# Altium project iMX6 Rex Development Baseboard V1I1.PrjPcb (part 2 of 2)

## Sheet [08] - LVDS.SchDoc
size A3; DocumentNumber: 2; SheetNumber: 8; SheetTotal: 20
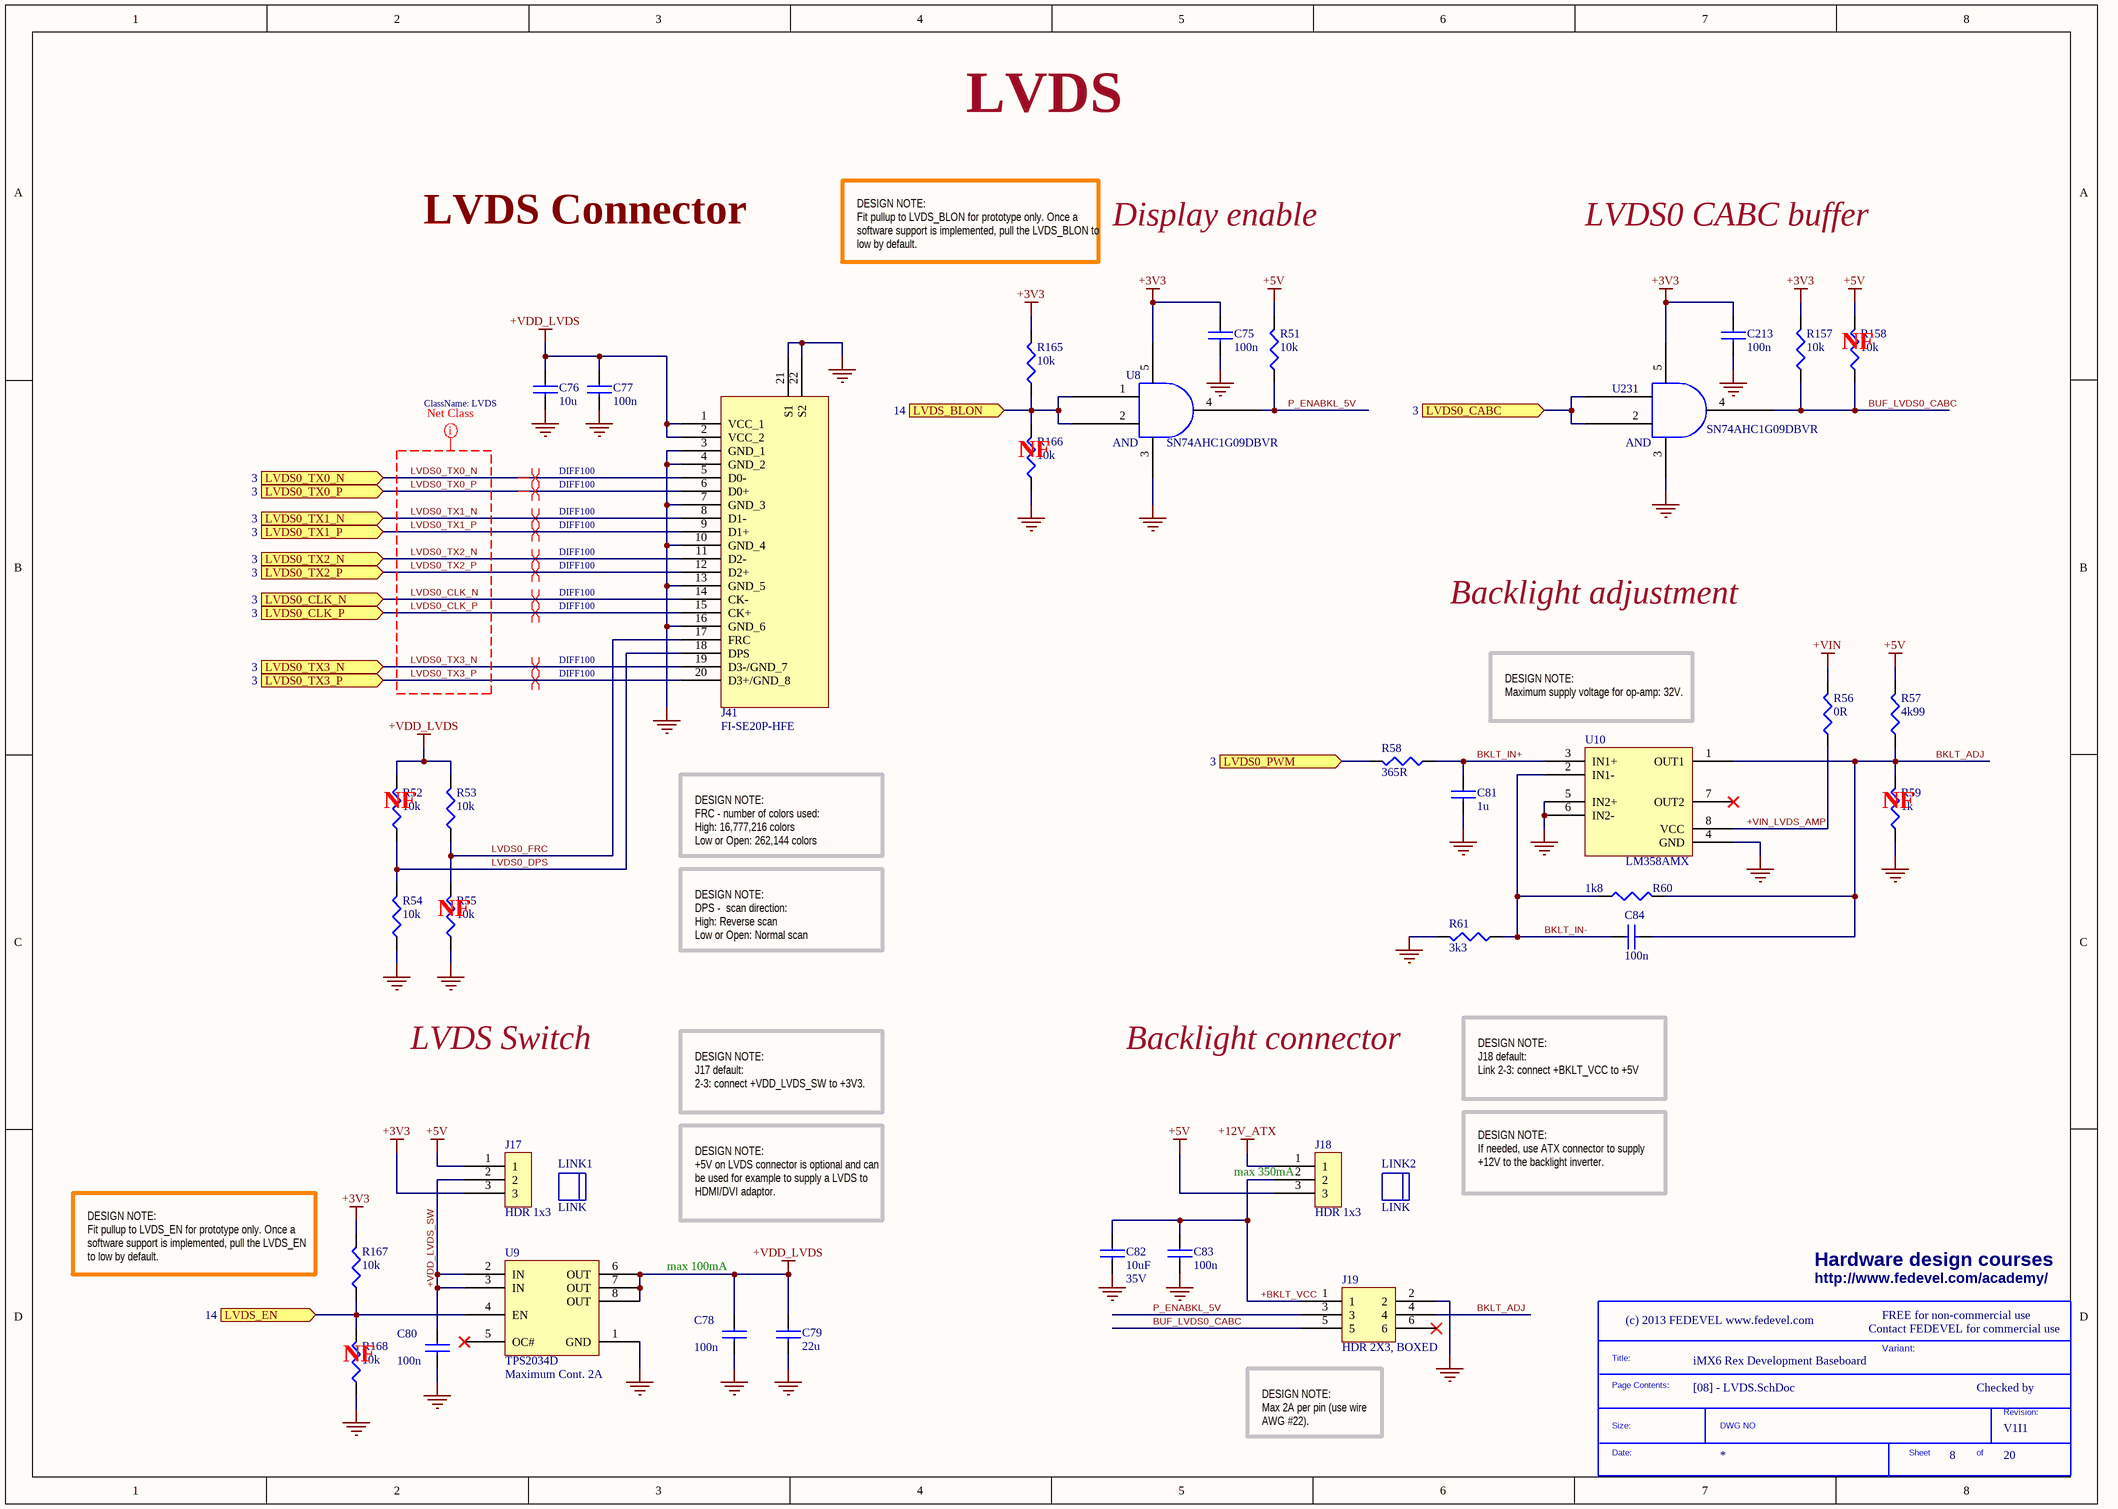
[diagram p4: [08] - LVDS.SchDoc]

### Parts
(Parts that share a designator on the sheet are numbered #1, #2 ... from top to bottom, then left to right.)
*#3  SDTitleBlock  (value not drawn)  (graphical)
C75  100n  [C0402]
C76  10u  [C0603]
C77  100n  [C0402]
C78  100n  [C0402]
C79  22u  [C0805]
C80  100n  [C0402]
C81  1u  [C0402]
C82  10uF  Voltage - Rated: 35V  [C1206]
C83  100n  [C0402]
C84  100n  [C0402]
C213  100n  [C0402]
J17  HDR 1x3  [Hdr_1x3_2.54mm]
J18  HDR 1x3  [Hdr_1x3_2.54mm]
J19  HDR 2X3, BOXED  [HDR_2x3_2.54mm_BOXED]
J41  FI-SE20P-HFE  [FI-SE20P-HFE]
LINK1  LINK  (mechanical)
LINK2  LINK  (mechanical)
R51  10k  [R0402]
R52  10k  [R0402]
R53  10k  [R0402]
R54  10k  [R0402]
R55  10k  [R0402]
R56  0R  [R0402]
R57  4k99  [R0402]
R58  365R  [R0402]
R59  1k  [R0402]
R60  1k8  [R0402]
R61  3k3  [R0402]
R157  10k  [R0402]
R158  10k  [R0402]
R165  10k  [R0402]
R166  10k  [R0402]
R167  10k  [R0402]
R168  10k  [R0402]
U8  SN74AHC1G09DBVR  [DBV_SOT_23_5]
U9  TPS2034D  [8_SOIC_3.9MM]
U10  LM358AMX  [8_SOIC_3.9MM]
U23  SN74AHC1G09DBVR  [DBV_SOT_23_5]

### Ports
LVDS0_CABC (in, see 3), LVDS0_CLK_N (in, see 3), LVDS0_CLK_P (in, see 3), LVDS0_PWM (in, see 3), LVDS0_TX0_N (in, see 3), LVDS0_TX0_P (in, see 3), LVDS0_TX1_N (in, see 3), LVDS0_TX1_P (in, see 3), LVDS0_TX2_N (in, see 3), LVDS0_TX2_P (in, see 3), LVDS0_TX3_N (in, see 3), LVDS0_TX3_P (in, see 3), LVDS_BLON (in, see 14), LVDS_EN (in, see 14)

### Nets
+3V3: C75.1 C213.1 J17.3 R157.2 R165.2 R167.2 U8.5(VCC) U23.5(VCC)
+5V: J17.1 J18.3 R51.2 R57.2 R158.2
+12V_ATX: J18.1
+VDD_LVDS: C76.1 C77.1 C78.1 C79.1 J41.1(VCC_1) J41.2(VCC_2) R52.2 R53.2 U9.6(OUT) U9.7(OUT) U9.8(OUT)
+VIN: R56.2
GND: C75.2 C76.2 C77.2 C78.2 C79.2 C80.2 C81.2 C82.2 C83.2 C213.2 J19.2 J41.3(GND_1) J41.4(GND_2) J41.7(GND_3) J41.10(GND_4) J41.13(GND_5) J41.16(GND_6) J41.21(S1) J41.22(S2) R54.1 R55.1 R59.1 R61.2 R166.1 R168.1 U8.3(GND) U9.1(GND) U10.4(GND) U10.5(IN2+) U10.6(IN2-) U23.3(GND)
+BKLT_VCC: C82.1 C83.1 J18.2 J19.1
+VDD_LVDS_SW: C80.1 J17.2 U9.2(IN) U9.3(IN)
+VIN_LVDS_AMP: R56.1 U10.8(VCC)
BKLT_ADJ: C84.2 J19.4 R57.1 R59.2 R60.2 U10.1(OUT1)
BKLT_IN+: C81.1 R58.1 U10.3(IN1+)
BKLT_IN-: C84.1 R60.1 R61.1 U10.2(IN1-)
BUF_LVDS0_CABC: J19.5 R157.1 R158.1 U23.4(Y)
LVDS0_CABC: U23.1(A) U23.2(B) ; port LVDS0_CABC
LVDS0_CLK_N: J41.14(CK-) ; port LVDS0_CLK_N
LVDS0_CLK_P: J41.15(CK+) ; port LVDS0_CLK_P
LVDS0_DPS: J41.18(DPS) R52.1 R54.2
LVDS0_FRC: J41.17(FRC) R53.1 R55.2
LVDS0_PWM: R58.2 ; port LVDS0_PWM
LVDS0_TX0_N: J41.5(D0-) ; port LVDS0_TX0_N
LVDS0_TX0_P: J41.6(D0+) ; port LVDS0_TX0_P
LVDS0_TX1_N: J41.8(D1-) ; port LVDS0_TX1_N
LVDS0_TX1_P: J41.9(D1+) ; port LVDS0_TX1_P
LVDS0_TX2_N: J41.11(D2-) ; port LVDS0_TX2_N
LVDS0_TX2_P: J41.12(D2+) ; port LVDS0_TX2_P
LVDS0_TX3_N: J41.19(D3-/GND_7) ; port LVDS0_TX3_N
LVDS0_TX3_P: J41.20(D3+/GND_8) ; port LVDS0_TX3_P
LVDS_BLON: R165.1 R166.2 U8.1(A) U8.2(B) ; port LVDS_BLON
LVDS_EN: R167.1 R168.2 U9.4(EN) ; port LVDS_EN
P_ENABKL_5V: J19.3 R51.1 U8.4(Y)

Not connected (* = marked no-connect by the designer): J19 6*; U9 5(OC#)*; U10 7(OUT2)*

### Layout directives
differential pair; net class DIFF100: LVDS0_CLK_N, LVDS0_CLK_P, LVDS0_TX0_N, LVDS0_TX0_P, LVDS0_TX1_N, LVDS0_TX1_P, LVDS0_TX2_N, LVDS0_TX2_P, LVDS0_TX3_N, LVDS0_TX3_P
net class LVDS: LVDS0_CLK_N, LVDS0_CLK_P, LVDS0_TX0_N, LVDS0_TX0_P, LVDS0_TX1_N, LVDS0_TX1_P, LVDS0_TX2_N, LVDS0_TX2_P, LVDS0_TX3_N, LVDS0_TX3_P

### Notes on the sheet
- LVDS
- LVDS Connector
- Display enable
- LVDS0 CABC buffer
- DESIGN NOTE:
  Fit pullup to LVDS_BLON for prototype only. Once a software support is implemented, pull the LVDS_BLON to low by default.
- (near R158) NF
- (near R166) NF
- Backlight adjustment
- (near U10) DESIGN NOTE:
  Maximum supply voltage for op-amp: 32V.
- (near R52) NF
- DESIGN NOTE:
  FRC - number of colors used:
  High: 16,777,216 colors
  Low or Open: 262,144 colors
- (near R59) NF
- (near R55) NF
- DESIGN NOTE:
  DPS -  scan direction:
  High: Reverse scan
  Low or Open: Normal scan
- LVDS Switch
- Backlight connector
- DESIGN NOTE:
  J17 default:
  2-3: connect +VDD_LVDS_SW to +3V3.
- DESIGN NOTE:
  J18 default:
  Link 2-3: connect +BKLT_VCC to +5V
- (near J18) max 350mA
- DESIGN NOTE:
  If needed, use ATX connector to supply +12V to the backlight inverter.
- DESIGN NOTE:
  +5V on LVDS connector is optional and can be used for example to supply a LVDS to HDMI/DVI adaptor.
- Hardware design courses
- (near R167) DESIGN NOTE:
  Fit pullup to LVDS_EN for prototype only. Once a software support is implemented, pull the LVDS_EN to low by default.
- max 100mA
- http://www.fedevel.com/academy/
- Contact FEDEVEL for commercial use
- FREE for non-commercial use
- (near R168) NF
- (near U9) Maximum Cont. 2A
- Variant:
- Checked by
- DESIGN NOTE:
  Max 2A per pin (use wire AWG #22).
- (in symbol SDTitleBlock) Title:; Page Contents:; Revision:; Size:; DWG NO; Date:; Sheet; of
- (in symbol SN74AHC1G09DBVR) AND

### Library data of the parts
C75 C77 C78 C80 C83 C84 C213 = C1005X5R1H104K: CAP CER .10UF 50V X5R 10% 0402; Manufacturer: TDK Corporation; Capacitance: 0.1µF; Value: 100nF; .Checked PCB: used; Description: CAP CER 0.1UF 50V 10% X5R 0402; Category: Capacitors; Manufacturer Part Number: C1005X5R1H104K; Operating Temperature: -55°C ~ 85°C; Package / Case: 0402 (1005 Metric); Price 1k [$]: 0.02340; .Checked SCH: used; Voltage - Rated: 50V; Supplier Part Number: 445-5942-1-ND; Supplier: Digikey; Supplier 1: Digi-Key; Supplier Part Number 1: 445-5942-1-ND; RoHS: RoHS Compliant; Stock 1: 106926; Pricing 1: 1=0.27, 10=0.18, 100=0.072, 250=0.05176, 500=0.0369, 1000=0.027 (USD); Tolerance: ±10%; Temperature Coefficient: X5R; Mounting Type: Surface Mount, MLCC; Applications: General Purpose; Ratings: -; Size / Dimension: 0.039" L x 0.020" W (1.00mm x 0.50mm); Height - Seated (Max): -; Thickness (Max): 0.022" (0.55mm); Lead Spacing: -; Features: -; Packaging: Cut Tape (CT); Lead Style: -; ComponentLink1URL: http://www.tdk.co.jp/tefe02/e412_c.pdf; ComponentLink1Description: http://www.tdk.co.jp/tefe02/e412_c.pdf
C76 = C1608X5R0J106M: CAP CER 10UF 6.3V X5R 20% 0603; Manufacturer: TDK Corporation; Capacitance: 10µF; Value: 10µF; .Checked PCB: used; Description: CAP CER 10UF 6.3V 20% X5R 0603; Category: Capacitors; Supplier Part Number: 445-4112-1-ND; Manufacturer Part Number: C1608X5R0J106M; Operating Temperature: -55°C ~ 85°C; Package / Case: 0603 (1608 Metric); Price 1k [$]: 0.08580; .Checked SCH: used; Voltage - Rated: 6.3V; Features: Low ESR; Supplier: Digikey; Supplier 1: Digi-Key; Supplier Part Number 1: 445-4112-1-ND; RoHS: RoHS Compliant; Stock 1: 48157; Pricing 1: 1=0.46, 10=0.363, 100=0.1898, 250=0.14024, 500=0.1089, 1000=0.0858 (USD); Tolerance: ±20%; Temperature Coefficient: X5R; Mounting Type: Surface Mount, MLCC; Applications: General Purpose; Ratings: -; Size / Dimension: 0.063" L x 0.031" W (1.60mm x 0.80mm); Height - Seated (Max): -; Thickness (Max): 0.037" (0.95mm); Lead Spacing: -; Packaging: Cut Tape (CT); Lead Style: -; ComponentLink1URL: http://www.tdk.com/pdf/general_B11.pdf; ComponentLink1Description: http://www.tdk.com/pdf/general_B11.pdf
C79 = C2012X5R1C226K: CAP CER 22UF 16V 10% X5R 0805; Manufacturer: TDK Corporation; Capacitance: 22µF; .Checked PCB: RF; Supplier 1: Digi-Key; Supplier Part Number 1: 445-6797-1-ND; Manufacturer Part Number: C2012X5R1C226K; RoHS: RoHS Compliant; Category: Capacitors; Stock 1: 15408; Pricing 1: 1=0.77, 10=0.737, 100=0.3575, 250=0.297, 500=0.2695, 1000=0.2475 (USD); Voltage - Rated: 16V; Tolerance: ±10%; Temperature Coefficient: X5R; Mounting Type: Surface Mount, MLCC; Operating Temperature: -55°C ~ 85°C; Applications: General Purpose; Ratings: -; Package / Case: 0805 (2012 Metric); Size / Dimension: 0.079" L x 0.049" W (2.00mm x 1.25mm); Height - Seated (Max): -; Thickness (Max): 0.057" (1.45mm); Lead Spacing: -; Features: -; Packaging: Cut Tape (CT); Lead Style: -; ComponentLink1URL: http://www.tdk.com/pdf/general_B11.pdf; ComponentLink1Description: http://www.tdk.com/pdf/general_B11.pdf; .Checked SCH: RF
C81 = C1005X5R1C105K: CAP CER 1.0UF 16V X5R 0402; Manufacturer: TDK Corporation; Capacitance: 1.0µF; Value: 1uF; .Checked PCB: used; Description: CAP CER 1UF 16V 10% X5R 0402; Tolerance: ±10%; Category: Capacitors; Supplier Part Number: 445-4978-1-ND; Manufacturer Part Number: C1005X5R1C105K; Operating Temperature: -55°C ~ 85°C; Package / Case: 0402 (1005 Metric); Price 1k [$]: 0.02080; .Checked SCH: used; Voltage - Rated: 16V; Supplier: Digikey; Supplier 1: Digi-Key; Supplier Part Number 1: 445-4978-1-ND; RoHS: RoHS Compliant; Stock 1: 341010; Pricing 1: 1=0.24, 10=0.16, 100=0.064, 250=0.046, 500=0.0328, 1000=0.024 (USD); Temperature Coefficient: X5R; Mounting Type: Surface Mount, MLCC; Applications: General Purpose; Ratings: -; Size / Dimension: 0.039" L x 0.020" W (1.00mm x 0.50mm); Height - Seated (Max): -; Thickness (Max): 0.022" (0.55mm); Lead Spacing: -; Features: -; Packaging: Cut Tape (CT); Lead Style: -; ComponentLink1URL: http://www.tdk.co.jp/tefe02/e412_c.pdf; ComponentLink1Description: http://www.tdk.co.jp/tefe02/e412_c.pdf
C82 = GRM31CR6YA106KA12L: CAP CER 10UF 35V X5R 1206; Manufacturer: Murata Electronics North America; Capacitance: 10µF; .Checked PCB: used; Description: CAP CER 10UF 35V 10% X5R 1206; Tolerance: ±10%; Category: Capacitors; Supplier Part Number: 490-5524-1-ND; Manufacturer Part Number: GRM31CR6YA106KA12L; Operating Temperature: -55°C ~ 85°C; Package / Case: 1206 (3216 Metric); Price 1k [$]: 0.19448; Value: 10uF; .Checked SCH: used; Supplier: Digikey; Supplier 1: Digi-Key; Supplier Part Number 1: 490-5524-1-ND; RoHS: RoHS Compliant; Stock 1: 76334; Pricing 1: 1=0.6, 10=0.501, 50=0.359, 100=0.3142, 250=0.24684, 500=0.2244, 1000=0.17952 (USD); Temperature Coefficient: X5R; Mounting Type: Surface Mount, MLCC; Applications: General Purpose; Ratings: -; Size / Dimension: 0.126" L x 0.063" W (3.20mm x 1.60mm); Height - Seated (Max): -; Thickness (Max): 0.071" (1.80mm); Lead Spacing: -; Features: -; Packaging: Cut Tape (CT); Lead Style: -; ComponentLink1URL: http://www.murata.com/products/catalog/pdf/c02e.pdf; ComponentLink1Description: http://www.murata.com/products/catalog/pdf/c02e.pdf
J17 J18 = 68000-103HLF: BERGSTIK II .100" SR STRAIGHT; Manufacturer: FCI; Connector Type: Header, Unshrouded; Number of Positions: 3; Number of Positions Loaded: All; Pitch: 0.100" (2.54mm); .Creator: MM; Supplier 1: Digi-Key; Manufacturer Part Number: 68000-103HLF; RoHS: RoHS Compliant; Category: Connectors, Interconnects; Stock 1: 37214; Pricing 1: 1=0.15, 10=0.145, 25=0.108, 50=0.0924 (USD); Packaging: Bulk; Contact Type: Male Pin; Number of Rows: 1; Row Spacing: -; Contact Mating Length: 0.230" (5.84mm); Mounting Type: Through Hole; Termination: Solder; Fastening Type: -; Features: -; Contact Finish: Gold or Gold, GXT™; Contact Finish Thickness: 30µin (0.76µm); Color: Black; ComponentLink1URL: http://portal.fciconnect.com/Comergent//fci/drawing/68000.pdf; ComponentLink1Description: http://portal.fciconnect.com/Comergent//fci/drawing/68000.pdf; Supplier Part Number 1: 609-3461-ND; .Checked PCB: MM; .Checked SCH: MM
J19 = 30306-6002HB: CONN HEADER 6POS DL STR GOLD; Manufacturer: 3M; Connector Type: Header, Shrouded; Number of Positions: 6; Number of Positions Loaded: All; Pitch: 0.100" (2.54mm); .Creator: MM; Supplier 1: Digi-Key; Manufacturer Part Number: 30306-6002HB; RoHS: RoHS Compliant; Category: Connectors, Interconnects; Stock 1: 1262; Pricing 1: 1=0.64, 10=0.6, 25=0.54, 50=0.48, 100=0.46, 250=0.42, 500=0.4, 1000=0.33, 2500=0.3 (USD); Packaging: Bulk; Contact Type: Male Pin; Number of Rows: 2; Row Spacing: 0.100" (2.54mm); Contact Mating Length: 0.236" (6.00mm); Mounting Type: Through Hole; Termination: Solder; Fastening Type: -; Features: -; Contact Finish: Gold; Contact Finish Thickness: Flash; Color: Black; ComponentLink1URL: http://multimedia.3m.com/mws/mediawebserver?6666660Zjcf6lVs6EVs666UdhCOrrrrQ-; ComponentLink1Description: http://multimedia.3m.com/mws/mediawebserver?6666660Zjcf6lVs6EVs666UdhCOrrrrQ-; Supplier Part Number 1: 3M15451-ND; .Checked PCB: MM; .Checked SCH: MM
J41 = FI-SE20P-HFE: CONN RCPT 1.25MM 20POS SMD R/A; Manufacturer: JAE Electronics; Connector Type: Receptacle; Number of Positions: 20; Number of Positions Loaded: All; Pitch: 0.049" (1.25mm); .Creator: MM; Supplier 1: Digi-Key; Manufacturer Part Number: FI-SE20P-HFE; RoHS: RoHS Compliant; Category: Connectors, Interconnects; Stock 1: 7292; Pricing 1: 1=4.93, 10=4.728, 25=4.334, 100=3.94, 250=3.44752, 500=3.349, 1000=2.8565 (USD); Packaging: Tray; Contact Type: Male Pin; Number of Rows: 1; Row Spacing: -; Contact Mating Length: -; Mounting Type: Surface Mount, Right Angle; Termination: Solder; Fastening Type: Friction Lock; Features: Solder Retention; Contact Finish: Gold; Contact Finish Thickness: -; Color: Beige; ComponentLink1URL: http://jae-connector.com/en/pdf/SJ100489.pdf; ComponentLink1Description: http://jae-connector.com/en/pdf/SJ100489.pdf; Supplier Part Number 1: 670-1843-ND; .Checked PCB: MM; .Checked SCH: MM
LINK1 LINK2 = QPC02SXGN-RC: CONN JUMPER SHORTING .100" GOLD; Manufacturer: Sullins Connector Solutions; Gender: Female Sockets; Number of Positions or Pins (Grid): 2 (1 x 2); Pitch: 0.100" (2.54mm); .Checked SCH: RF; Supplier 1: Digi-Key; Supplier Part Number 1: S9337-ND; Manufacturer Part Number: QPC02SXGN-RC; RoHS: RoHS Compliant; Category: Connectors, Interconnects; Stock 1: 23274; Pricing 1: 1=0.11, 10=0.066, 25=0.0468, 50=0.0384, 100=0.033, 250=0.02792, 500=0.0258, 1000=0.0228, 2500=0.018 (USD); Type: Open Top; Height: 0.235" (5.97mm); Contact Finish: Gold; Contact Finish Thickness: Flash; Color: -; Packaging: Bulk; ComponentLink1URL: http://www.sullinscorp.com/drawings/284_SXGN_11510.pdf; ComponentLink1Description: http://www.sullinscorp.com/drawings/284_SXGN_11510.pdf
R51-R55 R157 R158 R165-R168 = RC0402FR-0710KL: RES 10.0K OHM 1/16W 1% 0402 SMD; Manufacturer: Yageo; Power (Watts): 0.063W, 1/16W; .Checked PCB: used; Temperature Coefficient: ±100ppm/°C; Category: Resistors; Supplier Part Number: 311-10.0KLRCT-ND; Manufacturer Part Number: RC0402FR-0710KL; Package / Case: 0402 (1005 Metric); Price 1k [$]: 0.01421; Resistance (Ohms): 10K; Tolerance: ±1%; Value: 10k; .Checked SCH: used; Supplier: Digikey; Supplier 1: Digi-Key; Supplier Part Number 1: 311-10.0KLRCT-ND; RoHS: RoHS Compliant; Stock 1: 2916495; Pricing 1: 10=0.014, 50=0.0104, 100=0.0079, 250=0.00584, 500=0.00432, 1000=0.00288 (USD); Composition: Thick Film; Features: -; Size / Dimension: 0.039" L x 0.020" W (1.00mm x 0.50mm); Height: 0.016" (0.40mm); Number of Terminations: 2; Packaging: Cut Tape (CT); ComponentLink1URL: http://www.yageo.com/documents/recent/PYu-RC0402_51_RoHS_L_6.pdf; ComponentLink1Description: http://www.yageo.com/documents/recent/PYu-RC0402_51_RoHS_L_6.pdf
R56 = RC0402JR-070RL: RES 0.0 OHM 1/16W 0402 SMD; Manufacturer: Yageo; Resistance (Ohms): 0.0; Power (Watts): 0.063W, 1/16W; Tolerance: Jumper; .Checked PCB: used; Category: Resistors; Supplier Part Number: 311-0.0JRCT-ND; Manufacturer Part Number: RC0402JR-070RL; Package / Case: 0402 (1005 Metric); Price 1k [$]: 0.01389; Value: 0R; .Checked SCH: used; Supplier: Digikey; Supplier 1: Digi-Key; Supplier Part Number 1: 311-0.0JRCT-ND; RoHS: RoHS Compliant; Stock 1: 1106330; Pricing 1: 10=0.012, 50=0.009, 100=0.0069, 250=0.00512, 500=0.0038, 1000=0.00253 (USD); Composition: Thick Film; Features: -; Temperature Coefficient: -; Size / Dimension: 0.039" L x 0.020" W (1.00mm x 0.50mm); Height: 0.016" (0.40mm); Number of Terminations: 2; Packaging: Cut Tape (CT); ComponentLink1URL: http://www.yageo.com/documents/recent/PYu-RC0402_51_RoHS_L_6.pdf; ComponentLink1Description: http://www.yageo.com/documents/recent/PYu-RC0402_51_RoHS_L_6.pdf
R57 = RMCF0402FT4K99: RES TF 4.99K OHM 1% 1/16W 0402; Manufacturer: Stackpole Electronics Inc; Power (Watts): 0.063W, 1/16W; .Checked PCB: used; Temperature Coefficient: ±100ppm/°C; Category: Resistors; Supplier Part Number: RMCF0402FT4K99CT-ND; Manufacturer Part Number: RMCF0402FT4K99; Package / Case: 0402 (1005 Metric); Price 1k [$]: 0.00384; Resistance (Ohms): 4.99K; Tolerance: ±1%; Value: 4k99; .Checked SCH: used; Supplier: Digikey; Supplier 1: Digi-Key; Supplier Part Number 1: RMCF0402FT4K99CT-ND; RoHS: RoHS Compliant; Stock 1: 48509; Pricing 1: 1=0.04, 10=0.025, 50=0.0138, 100=0.0105, 250=0.0078, 500=0.00576, 1000=0.00384 (USD); Composition: Thick Film; Features: -; Size / Dimension: 0.039" L x 0.020" W (1.00mm x 0.50mm); Height: 0.016" (0.40mm); Number of Terminations: 2; Packaging: Cut Tape (CT); ComponentLink1URL: http://www.seielect.com/Catalog/SEI-RMCF.pdf; ComponentLink1Description: http://www.seielect.com/Catalog/SEI-RMCF.pdf
R58 = RMCF0402FT365R: RES TF 365 OHM 1% 1/16W 0402; Manufacturer: Stackpole Electronics Inc; Resistance (Ohms): 365; Power (Watts): 0.063W, 1/16W; .Checked PCB: RF; Temperature Coefficient: ±100ppm/°C; Category: Resistors; Supplier Part Number: RMCF0402FT365RCT-ND; Manufacturer Part Number: RMCF0402FT365R; Package / Case: 0402 (1005 Metric); Price 1k [$]: 0.00384; Tolerance: ±1%; Value: 365R; .Checked SCH: RF; Supplier: Digikey; Supplier 1: Digi-Key; Supplier Part Number 1: RMCF0402FT365RCT-ND; RoHS: RoHS Compliant; Stock 1: 28385; Pricing 1: 1=0.04, 10=0.025, 50=0.0138, 100=0.0105, 250=0.0078, 500=0.00576, 1000=0.00384 (USD); Composition: Thick Film; Features: -; Size / Dimension: 0.039" L x 0.020" W (1.00mm x 0.50mm); Height: 0.016" (0.40mm); Number of Terminations: 2; Packaging: Cut Tape (CT); ComponentLink1URL: http://www.seielect.com/Catalog/SEI-RMCF.pdf; ComponentLink1Description: http://www.seielect.com/Catalog/SEI-RMCF.pdf
R59 = RC0402FR-071KL: RES 1.00K OHM 1/16W 1% 0402 SMD; Manufacturer: Yageo; Power (Watts): 0.063W, 1/16W; .Checked PCB: used; Temperature Coefficient: ±100ppm/°C; Category: Resistors; Supplier Part Number: 311-1.00KLRCT-ND; Manufacturer Part Number: RC0402FR-071KL; Package / Case: 0402 (1005 Metric); Price 1k [$]: 0.01421; Resistance (Ohms): 1K; Tolerance: ±1%; Value: 1k; .Checked SCH: used; Supplier: Digikey; Supplier 1: Digi-Key; Supplier Part Number 1: 311-1.00KLRCT-ND; RoHS: RoHS Compliant; Stock 1: 1753477; Pricing 1: 10=0.014, 50=0.0104, 100=0.0079, 250=0.00584, 500=0.00432, 1000=0.00288 (USD); Composition: Thick Film; Features: -; Size / Dimension: 0.039" L x 0.020" W (1.00mm x 0.50mm); Height: 0.016" (0.40mm); Number of Terminations: 2; Packaging: Cut Tape (CT); ComponentLink1URL: http://www.yageo.com/documents/recent/PYu-RC0402_51_RoHS_L_6.pdf; ComponentLink1Description: http://www.yageo.com/documents/recent/PYu-RC0402_51_RoHS_L_6.pdf
R60 = CRCW04021K80FKED: RES 1.80K OHM 1/16W 1% 0402 SMD; Manufacturer: Vishay Dale; Resistance (Ohms): 1.8K; Power (Watts): 0.063W, 1/16W; Temperature Coefficient: ±100ppm/°C; .Checked PCB: RF; Supplier 1: Digi-Key; Supplier Part Number 1: 541-1.80KLCT-ND; Manufacturer Part Number: CRCW04021K80FKED; RoHS: RoHS Compliant; Category: Resistors; Stock 1: 48596; Pricing 1: 10=0.083, 50=0.0444, 200=0.0255, 1000=0.0174 (USD); Composition: Thick Film; Features: -; Tolerance: ±1%; Size / Dimension: 0.039" L x 0.020" W (1.00mm x 0.50mm); Height: 0.016" (0.40mm); Number of Terminations: 2; Packaging: Cut Tape (CT); Package / Case: 0402 (1005 Metric); ComponentLink1URL: http://www.vishay.com/doc?20035; ComponentLink1Description: http://www.vishay.com/doc?20035; .Checked SCH: RF
R61 = RC0402FR-073K3L: RES 3.30K OHM 1/16W 1% 0402 SMD; Manufacturer: Yageo; Resistance (Ohms): 3.3K; Power (Watts): 0.063W, 1/16W; .Checked PCB: used; Temperature Coefficient: ±100ppm/°C; Category: Resistors; Supplier Part Number: 311-3.30KLRCT-ND; Manufacturer Part Number: RC0402FR-073K3L; Package / Case: 0402 (1005 Metric); Price 1k [$]: 0.01421; Tolerance: ±1%; Value: 3k3; .Checked SCH: used; Supplier: Digikey; Supplier 1: Digi-Key; Supplier Part Number 1: 311-3.30KLRCT-ND; RoHS: RoHS Compliant; Stock 1: 356340; Pricing 1: 10=0.014, 50=0.0104, 100=0.0079, 250=0.00584, 500=0.00432, 1000=0.00288 (USD); Composition: Thick Film; Features: -; Size / Dimension: 0.039" L x 0.020" W (1.00mm x 0.50mm); Height: 0.016" (0.40mm); Number of Terminations: 2; Packaging: Cut Tape (CT); ComponentLink1URL: http://www.yageo.com/documents/recent/PYu-RC0402_51_RoHS_L_6.pdf; ComponentLink1Description: http://www.yageo.com/documents/recent/PYu-RC0402_51_RoHS_L_6.pdf
U8 U23 = SN74AHC1G09DBVR: IC GATE AND SGL 2INP SOT23-5; Manufacturer: Texas Instruments; Logic Type: AND Gate; Number of Circuits: 1; Number of Inputs: 2; Voltage - Supply: 2 V ~ 5.5 V; Current - Quiescent (Max): 1µA; Current - Output High, Low: -, 8mA; Logic Level - Low: 0.5 V ~ 1.65 V; Logic Level - High: 1.5 V ~ 3.85 V; Max Propagation Delay @ V, Max CL: 7.5ns @ 5V, 50pF; .Creator: MM; .Checked PCB: RF, used by MM; .Checked SCH: MM, checked by RF; Supplier 1: Digi-Key; Manufacturer Part Number: SN74AHC1G09DBVR; RoHS: RoHS Compliant; Category: Integrated Circuits (ICs); Stock 1: 3468; Pricing 1: 1=0.49, 10=0.345, 25=0.2836, 100=0.2265, 250=0.165, 500=0.134, 1000=0.103 (USD); Features: Open Drain; Operating Temperature: -55°C ~ 125°C; Mounting Type: Surface Mount; Supplier Device Package: SOT-23-5; Package / Case: SC-74A, SOT-753; Packaging: Cut Tape (CT); ComponentLink1URL: http://www.ti.com/lit/ds/symlink/sn74ahc1g09.pdf; ComponentLink1Description: http://www.ti.com/lit/ds/symlink/sn74ahc1g09.pdf; Supplier Part Number 1: 296-29202-1-ND
U9 = TPS2034D: IC 3.0A POWER DIST SWITCH 8-SOIC; Manufacturer: Texas Instruments; Number of Outputs: 1; Rds (On): 36 mOhm; Internal Switch(s): Yes; Current Limit: 3A; Voltage - Input: 2.7 V ~ 5.5 V; .Checked PCB: RF; Supplier 1: Digi-Key; Supplier Part Number 1: 296-2569-5-ND; Manufacturer Part Number: TPS2034D; RoHS: RoHS Compliant; Category: Integrated Circuits (ICs); Stock 1: 2323; Pricing 1: 1=2.94, 25=2.3624, 100=2.1525, 250=1.94252, 500=1.743, 1000=1.47, 2500=1.3965, 5000=1.344, 10000=1.302 (USD); Type: High Side Switch; Operating Temperature: -40°C ~ 85°C; Mounting Type: Surface Mount; Package / Case: 8-SOIC (0.154", 3.90mm Width); Supplier Device Package: 8-SOIC; Packaging: Tube; ComponentLink1URL: http://www.ti.com/lit/ds/symlink/tps2031.pdf; ComponentLink1Description: http://www.ti.com/lit/ds/symlink/tps2031.pdf; .Checked SCH: RF
U10 = LM358AMX: IC OPAMP DUAL 0-70DEG C 8-SOIC; Manufacturer: Fairchild Semiconductor; Amplifier Type: General Purpose; Number of Circuits: 2; Slew Rate: 0.3 V/µs; Current - Input Bias: 45nA; Voltage - Input Offset: 2000µV; Current - Supply: 800µA; Current - Output / Channel: 30mA; Voltage - Supply, Single/Dual (±): 3 V ~ 32 V, ±1.5 V ~ 16 V; .Checked PCB: RF; Supplier 1: Digi-Key; Supplier Part Number 1: LM358AMXFSCT-ND; Manufacturer Part Number: LM358AMX; RoHS: RoHS Compliant; Category: Integrated Circuits (ICs); Stock 1: 15608; Pricing 1: 1=0.47, 25=0.31, 100=0.2547, 250=0.21224, 500=0.17632, 750=0.14692, 1000=0.1306 (USD); Output Type: -; Gain Bandwidth Product: -; -3db Bandwidth: -; Operating Temperature: 0°C ~ 70°C; Mounting Type: Surface Mount; Package / Case: 8-SOIC (0.154", 3.90mm Width); Supplier Device Package: 8-SOIC; Packaging: Cut Tape (CT); ComponentLink1URL: http://www.fairchildsemi.com/ds/LM/LM358A.pdf; ComponentLink1Description: http://www.fairchildsemi.com/ds/LM/LM358A.pdf; .Checked SCH: RF

## Sheet [13] - UARTS.SchDoc
size A3; DocumentNumber: 2; SheetNumber: 13; SheetTotal: 20
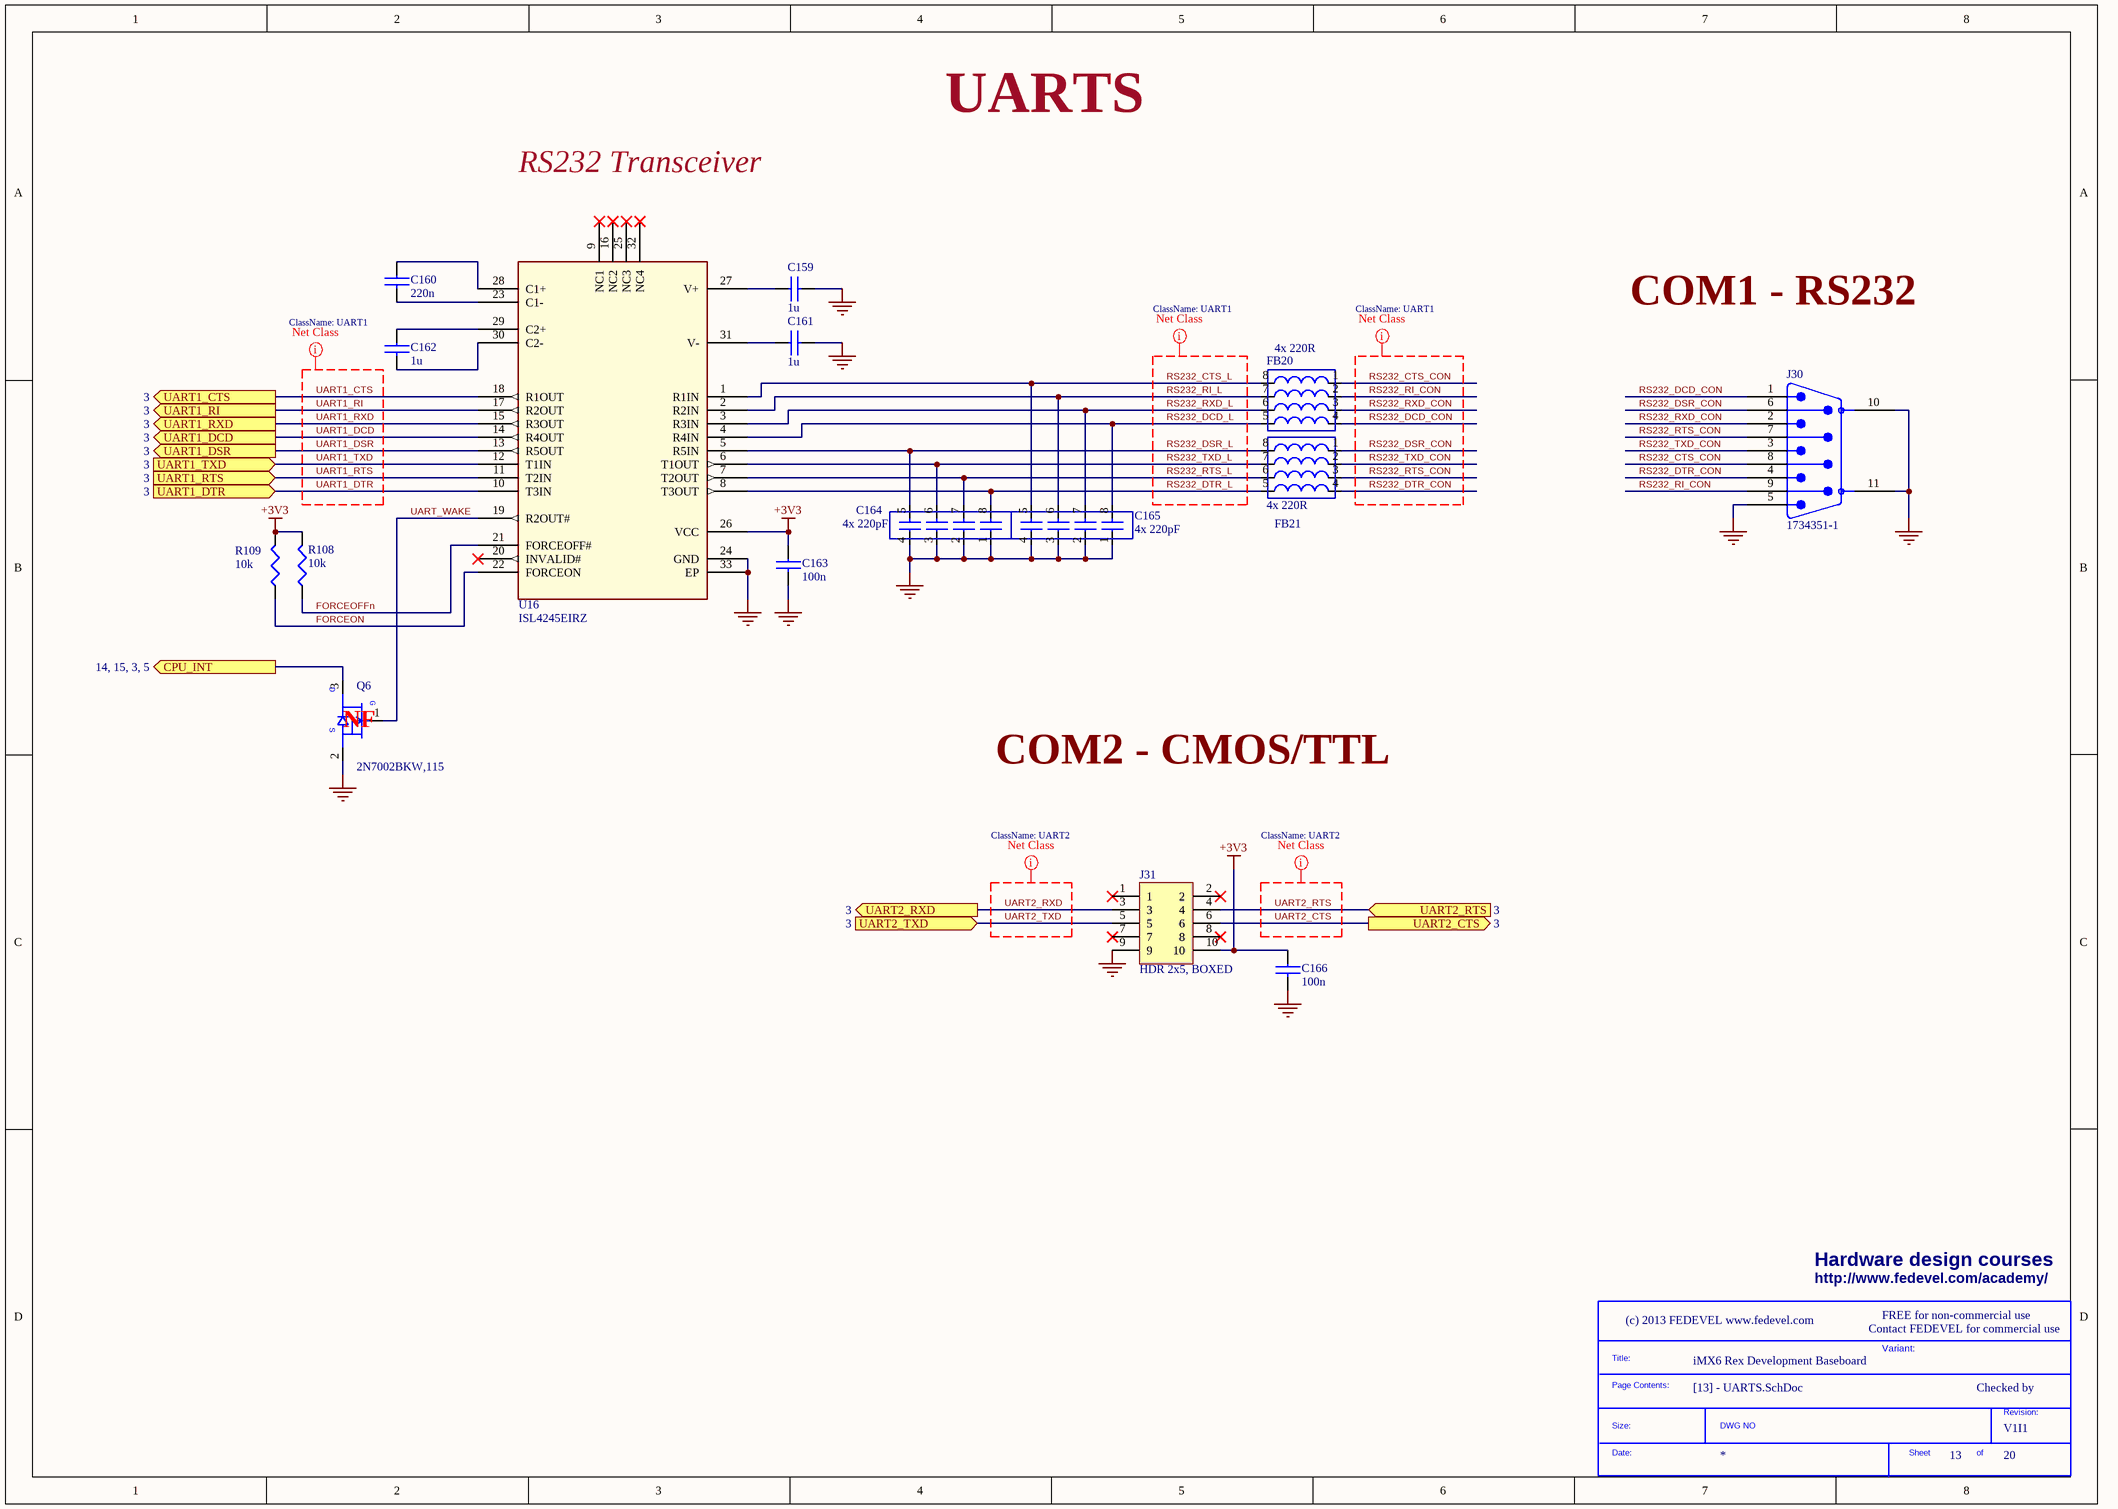
[diagram p5: [13] - UARTS.SchDoc]

### Parts
(Parts that share a designator on the sheet are numbered #1, #2 ... from top to bottom, then left to right.)
*#4  SDTitleBlock  (value not drawn)  (graphical)
C159  1u  [C0402]
C160  220n  [C0402]
C161  1u  [C0402]
C162  1u  [C0402]
C163  100n  [C0402]
C164  4x 220pF  [4x_CAP_CC0805_CKCL44]
C165  4x 220pF  [4x_CAP_CC0805_CKCL44]
C166  100n  [C0402]
FB20  4x 220R  [4x0402_BLA2A_MURATA]
FB21  4x 220R  [4x0402_BLA2A_MURATA]
J30  1734351-1  [DBA9_M_RA]
J31  HDR 2x5, BOXED  [HDR_2x5_2.54mm_BOXED]
Q6  2N7002BKW,115  [SC70_SOT323]
R108  10k  [R0402]
R109  10k  [R0402]
U16  ISL4245EIRZ  [QFN32 5x5x0.85]

### Ports
CPU_INT (out, see 14, 15, 3, 5), UART1_CTS (out, see 3), UART1_DCD (out, see 3), UART1_DSR (out, see 3), UART1_DTR (in, see 3), UART1_RI (out, see 3), UART1_RTS (in, see 3), UART1_RXD (out, see 3), UART1_TXD (in, see 3), UART2_CTS (out, see 3), UART2_RTS (in, see 3), UART2_RXD (out, see 3), UART2_TXD (in, see 3)

### Nets
+3V3: C163.1 C166.1 J31.10 R108.2 R109.2 U16.26(VCC)
GND: C159.2 C161.2 C163.2 C164.1 C164.2 C164.3 C164.4 C165.1 C165.2 C165.3 C165.4 C166.2 J30.5 J30.10(SHIELD) J30.11(SHIELD) J31.9 Q6.2(SOURCE) U16.24(GND) U16.33(EP)
CPU_INT: Q6.3(DRAIN) ; port CPU_INT
FORCEOFFn: R108.1 U16.21(FORCEOFF#)
FORCEON: R109.1 U16.22(FORCEON)
RS232_CTS_CON: FB20.1 J30.8
RS232_CTS_L: C165.5 FB20.8 U16.1(R1IN)
RS232_DCD_CON: FB20.4 J30.1
RS232_DCD_L: C165.8 FB20.5 U16.4(R4IN)
RS232_DSR_CON: FB21.1 J30.6
RS232_DSR_L: C164.5 FB21.8 U16.5(R5IN)
RS232_DTR_CON: FB21.4 J30.4
RS232_DTR_L: C164.8 FB21.5 U16.8(T3OUT)
RS232_RI_CON: FB20.2 J30.9
RS232_RI_L: C165.6 FB20.7 U16.2(R2IN)
RS232_RTS_CON: FB21.3 J30.7
RS232_RTS_L: C164.7 FB21.6 U16.7(T2OUT)
RS232_RXD_CON: FB20.3 J30.2
RS232_RXD_L: C165.7 FB20.6 U16.3(R3IN)
RS232_TXD_CON: FB21.2 J30.3
RS232_TXD_L: C164.6 FB21.7 U16.6(T1OUT)
UART1_CTS: U16.18(R1OUT) ; port UART1_CTS
UART1_DCD: U16.14(R4OUT) ; port UART1_DCD
UART1_DSR: U16.13(R5OUT) ; port UART1_DSR
UART1_DTR: U16.10(T3IN) ; port UART1_DTR
UART1_RI: U16.17(R2OUT) ; port UART1_RI
UART1_RTS: U16.11(T2IN) ; port UART1_RTS
UART1_RXD: U16.15(R3OUT) ; port UART1_RXD
UART1_TXD: U16.12(T1IN) ; port UART1_TXD
UART2_CTS: J31.6 ; port UART2_CTS
UART2_RTS: J31.4 ; port UART2_RTS
UART2_RXD: J31.3 ; port UART2_RXD
UART2_TXD: J31.5 ; port UART2_TXD
UART_WAKE: Q6.1(GATE) U16.19(R2OUT#)
NetC159_1: C159.1 U16.27(V+)
NetC160_1: C160.1 U16.28(C1+)
NetC160_2: C160.2 U16.23(C1-)
NetC161_1: C161.1 U16.31(V-)
NetC162_1: C162.1 U16.29(C2+)
NetC162_2: C162.2 U16.30(C2-)

Not connected (* = marked no-connect by the designer): J31 1* 2* 7* 8*; U16 9(NC1)* 16(NC2)* 20(INVALID#)* 25(NC3)* 32(NC4)*

### Layout directives
net class UART1: RS232_CTS_CON, RS232_CTS_L, RS232_DCD_CON, RS232_DCD_L, RS232_DSR_CON, RS232_DSR_L, RS232_DTR_CON, RS232_DTR_L, RS232_RI_CON, RS232_RI_L, RS232_RTS_CON, RS232_RTS_L, RS232_RXD_CON, RS232_RXD_L, RS232_TXD_CON, RS232_TXD_L, UART1_CTS, UART1_DCD, UART1_DSR, UART1_DTR, UART1_RI, UART1_RTS, UART1_RXD, UART1_TXD
net class UART2: UART2_CTS, UART2_RTS, UART2_RXD, UART2_TXD

### Notes on the sheet
- RS232 Transceiver
- UARTS
- COM1 - RS232
- (near Q6) NF
- COM2 - CMOS/TTL
- Hardware design courses
- http://www.fedevel.com/academy/
- Contact FEDEVEL for commercial use
- FREE for non-commercial use
- Variant:
- Checked by
- (in symbol 2N7002BKW,115) D; G; S
- (in symbol SDTitleBlock) Title:; Page Contents:; Revision:; Size:; DWG NO; Date:; Sheet; of

### Library data of the parts
C159 C161 C162 = C1005X5R1C105K: as C81 on sheet [08] - LVDS; Category: Capacitors; Supplier Part Number: 445-4978-1-ND; Manufacturer Part Number: C1005X5R1C105K; Operating Temperature: -55°C ~ 85°C; Package / Case: 0402 (1005 Metric); Price 1k [$]: 0.02080; .Checked SCH: used; Voltage - Rated: 16V; Supplier: Digikey; Supplier 1: Digi-Key; Supplier Part Number 1: 445-4978-1-ND; RoHS: RoHS Compliant; Stock 1: 341010; Pricing 1: 1=0.24, 10=0.16, 100=0.064, 250=0.046, 500=0.0328, 1000=0.024 (USD); Temperature Coefficient: X5R; Mounting Type: Surface Mount, MLCC; Applications: General Purpose; Ratings: -; Size / Dimension: 0.039" L x 0.020" W (1.00mm x 0.50mm); Height - Seated (Max): -; Thickness (Max): 0.022" (0.55mm); Lead Spacing: -; Features: -; Packaging: Cut Tape (CT); Lead Style: -; ComponentLink1URL: http://www.tdk.co.jp/tefe02/e412_c.pdf; ComponentLink1Description: http://www.tdk.co.jp/tefe02/e412_c.pdf
C160 = C1005X5R1E224M: CAP CER .22UF 25V X5R 20% 0402; Manufacturer: TDK Corporation; Capacitance: 0.22µF; Value: 220nF; .Checked PCB: used; Description: CAP CER 0.22UF 25V 20% X5R 0402; Category: Capacitors; Supplier Part Number: 445-5945-1-ND; Manufacturer Part Number: C1005X5R1E224M; Operating Temperature: -55°C ~ 85°C; Package / Case: 0402 (1005 Metric); Price 1k [$]: 0.02600; .Checked SCH: used; Voltage - Rated: 25V; Supplier: Digikey; Supplier 1: Digi-Key; Supplier Part Number 1: 445-5945-1-ND; RoHS: RoHS Compliant; Stock 1: 54593; Pricing 1: 1=0.3, 10=0.2, 100=0.08, 250=0.05752, 500=0.041, 1000=0.03 (USD); Tolerance: ±20%; Temperature Coefficient: X5R; Mounting Type: Surface Mount, MLCC; Applications: General Purpose; Ratings: -; Size / Dimension: 0.039" L x 0.020" W (1.00mm x 0.50mm); Height - Seated (Max): -; Thickness (Max): 0.022" (0.55mm); Lead Spacing: -; Features: -; Packaging: Cut Tape (CT); Lead Style: -; ComponentLink1URL: http://www.tdk.co.jp/tefe02/e412_c.pdf; ComponentLink1Description: http://www.tdk.co.jp/tefe02/e412_c.pdf
C163 C166 = C1005X5R1H104K: as C75 on sheet [08] - LVDS; Category: Capacitors; Supplier Part Number: 445-5942-1-ND; Manufacturer Part Number: C1005X5R1H104K; Operating Temperature: -55°C ~ 85°C; Package / Case: 0402 (1005 Metric); Price 1k [$]: 0.02340; .Checked SCH: used; Voltage - Rated: 50V; Supplier: Digikey; Supplier 1: Digi-Key; Supplier Part Number 1: 445-5942-1-ND; RoHS: RoHS Compliant; Stock 1: 106926; Pricing 1: 1=0.27, 10=0.18, 100=0.072, 250=0.05176, 500=0.0369, 1000=0.027 (USD); Tolerance: ±10%; Temperature Coefficient: X5R; Mounting Type: Surface Mount, MLCC; Applications: General Purpose; Ratings: -; Size / Dimension: 0.039" L x 0.020" W (1.00mm x 0.50mm); Height - Seated (Max): -; Thickness (Max): 0.022" (0.55mm); Lead Spacing: -; Features: -; Packaging: Cut Tape (CT); Lead Style: -; ComponentLink1URL: http://www.tdk.co.jp/tefe02/e412_c.pdf; ComponentLink1Description: http://www.tdk.co.jp/tefe02/e412_c.pdf
C164 C165 = CKCL44X7R1H221M: CAP ARRAY 4CH 220PF 50V 0805; Manufacturer: TDK Corporation; Dielectric Material: Ceramic; Number of Capacitors: 4; Circuit Type: Isolated; Temperature Coefficient: X7R; Tolerance: ±20%; .Checked PCB: RF; Supplier 1: Digi-Key; Supplier Part Number 1: 445-1830-1-ND; Manufacturer Part Number: CKCL44X7R1H221M; RoHS: RoHS Compliant; Category: Capacitors; Stock 1: 43671; Pricing 1: 1=0.38, 10=0.297, 100=0.1553, 250=0.11476, 500=0.0891, 1000=0.0702 (USD); Capacitance: 220pF; Voltage - Rated: 50V; Mounting Type: Surface Mount; Package / Case: 0805 (2012 Metric); Size / Dimension: 0.079" L x 0.049" W (2.00mm x 1.25mm); Height - Seated (Max): 0.039" (1.00mm); Packaging: Cut Tape (CT); ComponentLink1URL: http://www.tdk.com/pdf/array_B11.pdf; ComponentLink1Description: http://www.tdk.com/pdf/array_B11.pdf; .Checked SCH: RF
FB20 FB21 = BLA2ABB221SN4D: FERRITE ARRAY 220 OHM 0804 SMD; Manufacturer: Murata Electronics North America; Impedance @ Frequency: 220 Ohm @ 100MHz; Current Rating: 50mA; DC Resistance (DCR): 900 mOhm Max; Filter Type: Differential Mode - 4 Line Array; Number of Lines: 4; .Checked PCB: RF; Supplier 1: Digi-Key; Supplier Part Number 1: 490-4010-1-ND; Manufacturer Part Number: BLA2ABB221SN4D; RoHS: RoHS Compliant; Category: Filters; Stock 1: 32117; Pricing 1: 1=0.68, 10=0.57, 50=0.4082, 100=0.3572, 250=0.28064, 500=0.25512, 1000=0.2041, 5000=0.15732 (USD); Package / Case: 0804 (2010 Metric), Array, 8 PC Pad; Mounting Type: Surface Mount; Packaging: Cut Tape (CT); Height (Max): 0.024" (0.60mm); Size / Dimension: 0.079" L x 0.039" W (2.00mm x 1.00mm); ComponentLink1URL: http://search.murata.co.jp/Ceramy/image/img/PDF/ENG/L0110S0102BLA2AA~BLA2AB.pdf; ComponentLink1Description: http://search.murata.co.jp/Ceramy/image/img/PDF/ENG/L0110S0102BLA2AA~BLA2AB.pdf; .Checked SCH: RF
J30 = 1734351-1: CONN D-SUB PLUG R/A 9POS GOLD/FL; Manufacturer: TE Connectivity; .Checked PCB: used; Connector Type: Plug, Male Pins; Number of Positions: 9; Flange Feature: Mating Side; Female Screwlock (4-40); Voltage Rating: 250V; Current Rating: 2A; .Checked SCH: used; Category: Connectors, Interconnects; Family: D-Sub; Manufacturer Part Number: 1734351-1; Operating Temperature: -55°C ~ 105°C; Price 1k [$]: 0.63612; Supplier: Digikey; Supplier Part Number: A35105-ND; Value: 1734351-1; Supplier 1: Digi-Key; Supplier Part Number 1: A35105-ND; RoHS: RoHS Compliant; Stock 1: 11510; Pricing 1: 1=1.17, 10=1.026, 25=0.9656, 50=0.9254, 100=0.8852, 250=0.80476, 500=0.72428, 1000=0.64381, 2500=0.58345 (USD); Connector Style: D-Sub; Number of Rows: 2; Shell Size, Connector Layout: 1 (DE, E); Contact Type: Signal; Mounting Type: Through Hole, Right Angle; Termination: Solder; Features: Board Lock, Grounding Indents; Shell Material, Finish: Steel, Nickel Plated; Contact Finish: Gold; Contact Finish Thickness: Flash; Ingress Protection: -; Housing Material: Polybutylene Terephthalate (PBT); Color: Black; ComponentLink1URL: http://documents.tycoelectronics.com/commerce/DocumentDelivery/DDEController?Action=srchrtrv&DocNm=1734351&DocType=CD&DocLang=EN; ComponentLink1Description: http://documents.tycoelectronics.com/commerce/DocumentDelivery/DDEController?Action=srchrtrv&DocNm=1734351&DocType=CD&DocLang=EN
J31 = D2510-6002-AR: CONN HEADER 10POS VERT 10GOLD; Manufacturer: 3M; Connector Type: Header, Shrouded; Number of Positions: 10; Number of Positions Loaded: All; Pitch: 0.100" (2.54mm); .Creator: MM; Supplier 1: Digi-Key; Manufacturer Part Number: D2510-6002-AR; RoHS: RoHS Compliant; Category: Connectors, Interconnects; Stock 1: 1080; Pricing 1: 1=1.57, 10=1.421, 50=1.276, 100=1.218, 250=1.102, 500=1.015, 1000=0.87, 2500=0.812, 5000=0.7714 (USD); Packaging: Bulk; Contact Type: Male Pin; Number of Rows: 2; Row Spacing: 0.100" (2.54mm); Contact Mating Length: 0.243" (6.17mm); Mounting Type: Through Hole; Termination: Solder; Fastening Type: -; Features: -; Contact Finish: Gold; Contact Finish Thickness: 10µin (0.25µm); Color: Black; ComponentLink1URL: http://multimedia.3m.com/mws/mediawebserver?66666UuZjcFSLXTtm8T_oxMcEVuQEcuZgVs6EVs6E666666--; ComponentLink1Description: http://multimedia.3m.com/mws/mediawebserver?66666UuZjcFSLXTtm8T_oxMcEVuQEcuZgVs6EVs6E666666--; Supplier Part Number 1: MHC10E-ND; .Checked PCB: MM; .Checked SCH: MM
Q6 = 2N7002BKW,115: MOSFET N-CH 60V 310MA SOT323; Manufacturer: NXP Semiconductors; FET Type: MOSFET N-Channel, Metal Oxide; FET Feature: Logic Level Gate; Rds On (Max) @ Id, Vgs: 1.6 Ohm @ 500mA, 10V; Vgs(th) (Max) @ Id: 2.1V @ 250µA; Gate Charge (Qg) @ Vgs: 0.6nC @ 4.5V; Input Capacitance (Ciss) @ Vds: 50pF @ 10V; Power - Max: 275mW; .Checked PCB: RF; Supplier 1: Digi-Key; Supplier Part Number 1: 568-5980-1-ND; Manufacturer Part Number: 2N7002BKW,115; RoHS: RoHS Compliant; Category: Discrete Semiconductor Products; Stock 1: 15666; Pricing 1: 1=0.39, 10=0.354, 25=0.2548, 100=0.1983, 250=0.12456, 500=0.10616, 1000=0.07233 (USD); Drain to Source Voltage (Vdss): 60V; Current - Continuous Drain (Id) @ 25° C: 310mA; Mounting Type: Surface Mount; Package / Case: SC-70, SOT-323; Supplier Device Package: SC-70; Packaging: Cut Tape (CT); ComponentLink1URL: http://www.nxp.com/documents/data_sheet/2N7002BKW.pdf; ComponentLink1Description: http://www.nxp.com/documents/data_sheet/2N7002BKW.pdf; .Checked SCH: RF
R108 R109 = RC0402FR-0710KL: as R51 on sheet [08] - LVDS; Category: Resistors; Supplier Part Number: 311-10.0KLRCT-ND; Manufacturer Part Number: RC0402FR-0710KL; Package / Case: 0402 (1005 Metric); Price 1k [$]: 0.01421; Resistance (Ohms): 10K; Tolerance: ±1%; Value: 10k; .Checked SCH: used; Supplier: Digikey; Supplier 1: Digi-Key; Supplier Part Number 1: 311-10.0KLRCT-ND; RoHS: RoHS Compliant; Stock 1: 2916495; Pricing 1: 10=0.014, 50=0.0104, 100=0.0079, 250=0.00584, 500=0.00432, 1000=0.00288 (USD); Composition: Thick Film; Features: -; Size / Dimension: 0.039" L x 0.020" W (1.00mm x 0.50mm); Height: 0.016" (0.40mm); Number of Terminations: 2; Packaging: Cut Tape (CT); ComponentLink1URL: http://www.yageo.com/documents/recent/PYu-RC0402_51_RoHS_L_6.pdf; ComponentLink1Description: http://www.yageo.com/documents/recent/PYu-RC0402_51_RoHS_L_6.pdf
U16 = ISL4245EIRZ: IC 3DRVR/5RCVR RS232 3V 32-QFN; Manufacturer: Intersil; Number of Drivers/Receivers: 3/5; Voltage - Supply: 2.7 V ~ 5.5 V; .Checked PCB: RF; Supplier 1: Digi-Key; Supplier Part Number 1: ISL4245EIRZ-ND; Manufacturer Part Number: ISL4245EIRZ; RoHS: RoHS Compliant; Category: Integrated Circuits (ICs); Stock 1: 1147; Pricing 1: 1=6.44, 25=5.23, 100=3.65 (USD); Type: Transceiver; Protocol: RS232; Mounting Type: Surface Mount; Package / Case: 32-VFQFN Exposed Pad; Supplier Device Package: 32-QFN Exposed Pad (5x5); Packaging: Tube; ComponentLink1URL: http://www.intersil.com/data/fn/fn8038.pdf; ComponentLink1Description: http://www.intersil.com/data/fn/fn8038.pdf; .Checked SCH: RF

## Nets that join several sheets
+3V3: [05] - PCIE MINI 2, AUDIO2 (9 pins), [08] - LVDS (8 pins), [13] - UARTS (6 pins)
+5V: [05] - PCIE MINI 2, AUDIO2 (FB4.1), [08] - LVDS (5 pins)
GND: [05] - PCIE MINI 2, AUDIO2 (94 pins), [08] - LVDS (31 pins), [13] - UARTS (19 pins)
CPU_INT: [05] - PCIE MINI 2, AUDIO2 (J9.1), [13] - UARTS (Q6.3)

## Assembly variants
Prototype: not fitted C16 C21 C26 C36 C95 C136 C138 C152 C153 C154 C155 C207 C208 C209 C210 C211 C212 C215 C217 D20 FB10 FB26 Q6 Q7 R1 R3 R5 R8 R10 R14 R24 R33 R36 R38 R40 R42 R52 R55 R59 R62 R64 R65 R68 R74 R75 R76 R88 R89 R104 R106 R111 R112 R113 R114 R116 R124 R125 R133 R151 R153 R154 R155 R156 R158 R160 R161 R162 R166 R168 R170 R171 R173 R174 R184 R185 U15